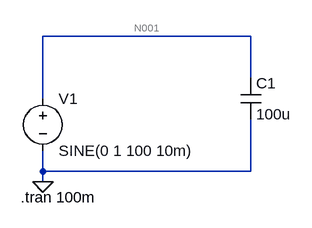
[diagram p0: schematic Yoneda-p61__Sine-wave_with-C=100u.asc]
Yoneda-p61__Sine-wave_with-C=100u.asc, the LTspice schematic file:
Version 4
SHEET 1 880 680
WIRE 416 0 96 0
WIRE 416 64 416 0
WIRE 96 96 96 0
WIRE 96 208 96 176
WIRE 416 208 416 128
WIRE 416 208 96 208
WIRE 96 224 96 208
FLAG 96 224 0
SYMBOL voltage 96 80 R0
WINDOW 123 0 0 Left 2
WINDOW 39 0 0 Left 2
SYMATTR InstName V1
SYMATTR Value SINE(0 1 100 10m)
SYMBOL cap 400 64 R0
SYMATTR InstName C1
SYMATTR Value 100u
TEXT 62 248 Left 2 !.tran 100m

The netlist it stands for:
* Yoneda-p61__Sine-wave_with-C=100u.asc
V1 N001 0 SINE(0 1 100 10m)
C1 N001 0 100u
.tran 100m
.backanno
.end

* Results of the author's LTspice run, read from the files saved beside the schematic
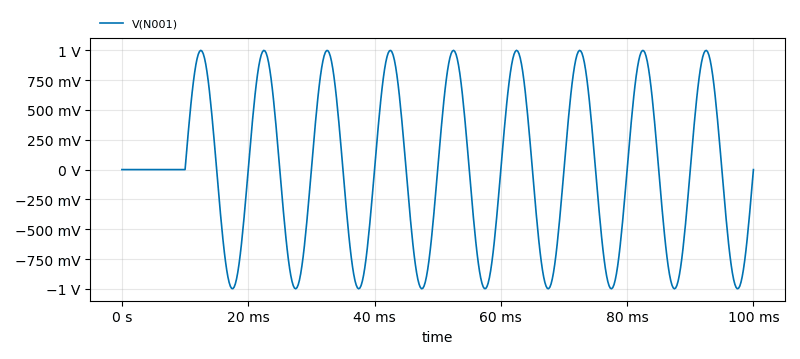
[diagram p1: Transient Analysis of Yoneda-p61__Sine-wave_with-C=100u.asc, plotted from the saved traces]
* Transient Analysis, 1 run:
*   V(N001): min -999 mV, max 999 mV, average 100.3 nV, rms 670.2 mV, last 0 V